# EasyEDA schematic SCH_AP-Controller_EasyEDA.json
TITLE: Sheet_1; REV: 2.0; Date: 2024-01-01; Sheet: 1/1; Drawn By: scottguiness; Company: Scott and Marco
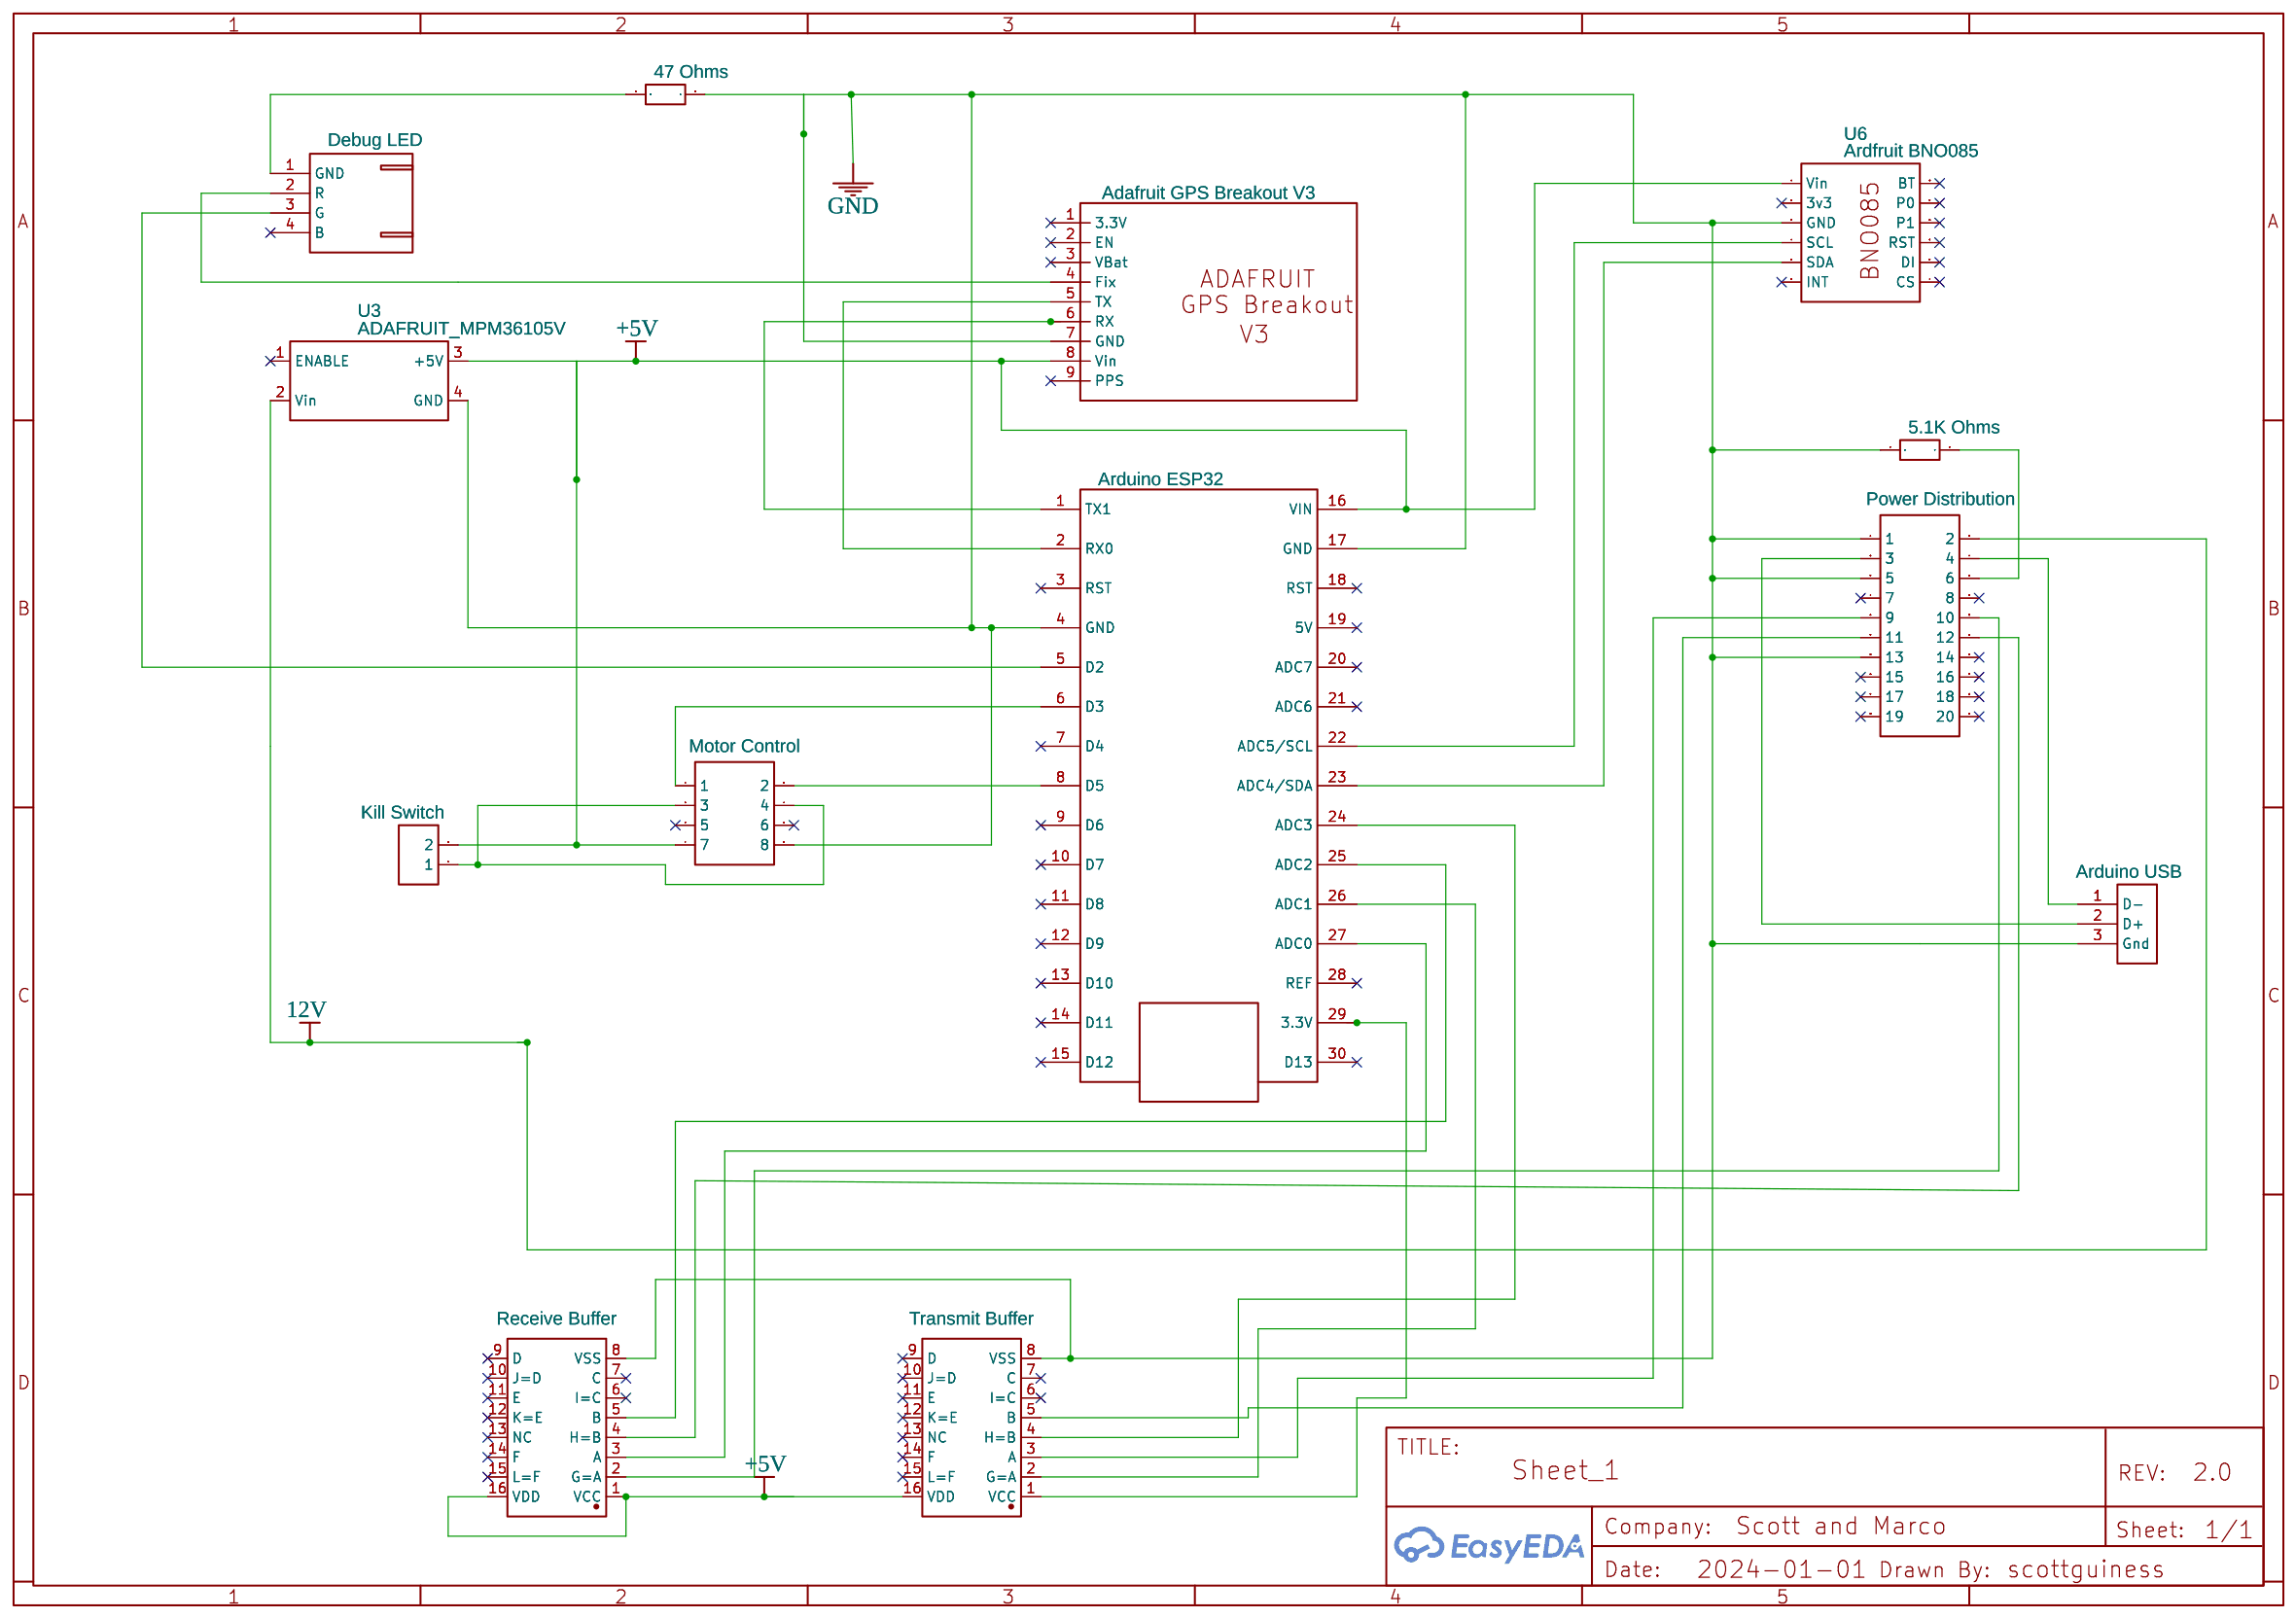
[diagram p0: schematic sheet]

## Parts
HDR-M-2.54_2X4  Motor Control  [HDR-M-2.54_2X4]
JST-XH-4-PIN  Debug LED  [JST XH 1X4]
JST_XH2.54_2P  Kill Switch  [2PIN_2.54_MM_JST_XHP_JST_CONNECTOR_FOR_DC_SOCKET]
JST_XH_1X3  Arduino USB  [JST XH 1X3]
POWER1  Power Distribution  [HDR-M-2.54_2X10]
R1  47 Ohms  [2W RESITOR]
R2  5.1K Ohms  [2W RESITOR]
U1  Arduino ESP32  [ADUINO NANO R3]
U2  Transmit Buffer  [PDIP-16_L19.3-W6.5-P2.54-LS7.6-BL]
U3  ADAFRUIT_MPM36105V  [ADAFRUIT_MPM3610_MODULE5]
U4  Adafruit GPS Breakout V3  [ADAFRUIT GPS BREAKOUT]
U5  Receive Buffer  [PDIP-16_L19.3-W6.5-P2.54-LS7.6-BL]
U6  Ardfruit BNO085  [ADAFRUIT-BNO085]

## Library data of the parts
HDR-M-2.54_2X4 = HDR-M-2.54_2x4: Supplier Part: C58363; Supplier: LCSC; Contributor: LCEDA_Lib
JST-XH-4-PIN = JST-XH-4-Pin: Contributor: loyboy
JST_XH2.54_2P = JST_XH2.54_2P: Contributor: Андрей Скиффи
JST_XH_1X3 = JST XH 1x3: Contributor: GeMeMe
POWER1 = HDR-M-2.54_2x10: Supplier Part: C124359; Supplier: LCSC; Contributor: LCEDA_Lib; Package Display: No
R1 R2 = 1w resistor: Contributor: Kagutsuchi
U1 = ARDUINO_NANO_R3: Contributor: Nikolay Yanev
U2 U5 = CD4010BE: Contributor: LCSC; Supplier: LCSC; Supplier Part: C2864860; Manufacturer: TI(德州仪器); JLCPCB Part Class: Extended Part
U3 = ADAFRUIT_MPM36105V: Supplier: Digi-Key; JLCPCB Part Class: Extended Part; Contributor: Aidan Farley
U4 = Adafruit GPS Breakout V3: Manufacturer Part: New SchematicLib; Contributor: NiklasC; Supplier Part: 746; Supplier: Adafruit; link: https://www.adafruit.com/product/746
U6 = Ardfruit BNO085: Manufacturer: Ardfruit; Contributor: Ashok Dhaker; Supplier: Adafruit

## Nets
12V: POWER1.2 U3.2(Vin)
+5V: HDR-M-2.54_2X4.7 JST_XH2.54_2P.2 U1.16(VIN) U2.16(VDD) U3.3(+5V) U4.8(Vin) U5.1(VCC) U5.16(VDD) U6.1(Vin)
GND: HDR-M-2.54_2X4.8 JST_XH_1X3.3(Gnd) POWER1.1 POWER1.5 POWER1.13 R1.2(1) R2.1(2) U1.4(GND) U1.17(GND) U2.8(VSS) U3.4(GND) U4.7(GND) U5.8(VSS) U6.3(GND)
Net-(HDR-M-2.54_2X4-1): HDR-M-2.54_2X4.1 U1.6(D3)
Net-(HDR-M-2.54_2X4-2): HDR-M-2.54_2X4.2 U1.8(D5)
Net-(HDR-M-2.54_2X4-3): HDR-M-2.54_2X4.3 HDR-M-2.54_2X4.4 JST_XH2.54_2P.1
Net-(JST-XH-4-PIN-1): JST-XH-4-PIN.1(GND) R1.1(2)
Net-(JST-XH-4-PIN-2): JST-XH-4-PIN.2(R) U4.4(Fix)
Net-(JST-XH-4-PIN-3): JST-XH-4-PIN.3(G) U1.5(D2)
Net-(JST_XH_1X3-1): JST_XH_1X3.1(D-) POWER1.4
Net-(JST_XH_1X3-2): JST_XH_1X3.2(D+) POWER1.3
Net-(POWER1-6): POWER1.6 R2.2(1)
Net-(POWER1-9): POWER1.9 U2.3(A)
Net-(POWER1-10): POWER1.10 U5.2(G=A)
Net-(POWER1-11): POWER1.11 U2.5(B)
Net-(POWER1-12): POWER1.12 U5.4(H=B)
Net-(U1-1): U1.1(TX1) U4.6(RX)
Net-(U1-2): U1.2(RX0) U4.5(TX)
Net-(U1-22): U1.22(ADC5/SCL) U6.4(SCL)
Net-(U1-23): U1.23(ADC4/SDA) U6.5(SDA)
Net-(U1-24): U1.24(ADC3) U2.4(H=B)
Net-(U1-25): U1.25(ADC2) U5.5(B)
Net-(U1-26): U1.26(ADC1) U2.2(G=A)
Net-(U1-27): U1.27(ADC0) U5.3(A)
Net-(U1-29): U1.29(3.3V) U2.1(VCC)

Not connected (* = marked no-connect by the designer): HDR-M-2.54_2X4 5* 6*; JST-XH-4-PIN 4(B)*; POWER1 7* 8* 14* 15* 16* 17* 18* 19* 20*; U1 3(RST)* 7(D4)* 9(D6)* 10(D7)* 11(D8)* 12(D9)* 13(D10)* 14(D11)* 15(D12)* 18(RST)* 19(5V)* 20(ADC7)* 21(ADC6)* 28(REF)* 30(D13)*; U2 6(I=C)* 7(C)* 9(D)* 10(J=D)* 11(E)* 12(K=E)* 13(NC)* 14(F)* 15(L=F)*; U3 1(ENABLE)*; U4 1(3.3V)* 2(EN)* 3(VBat)* 9(PPS)*; U5 6(I=C)* 7(C)* 9(D)* 10(J=D)* 11(E)* 12(K=E)* 13(NC)* 14(F)* 15(L=F)*; U6 2(3v3)* 6(INT)* 7(CS)* 8(DI)* 9(RST)* 10(P1)* 11(P0)* 12(BT)*
